# EAGLE schematic RD2166-v1.0.0 (EAGLE 9.3.1)

## Sheet 1 of 5
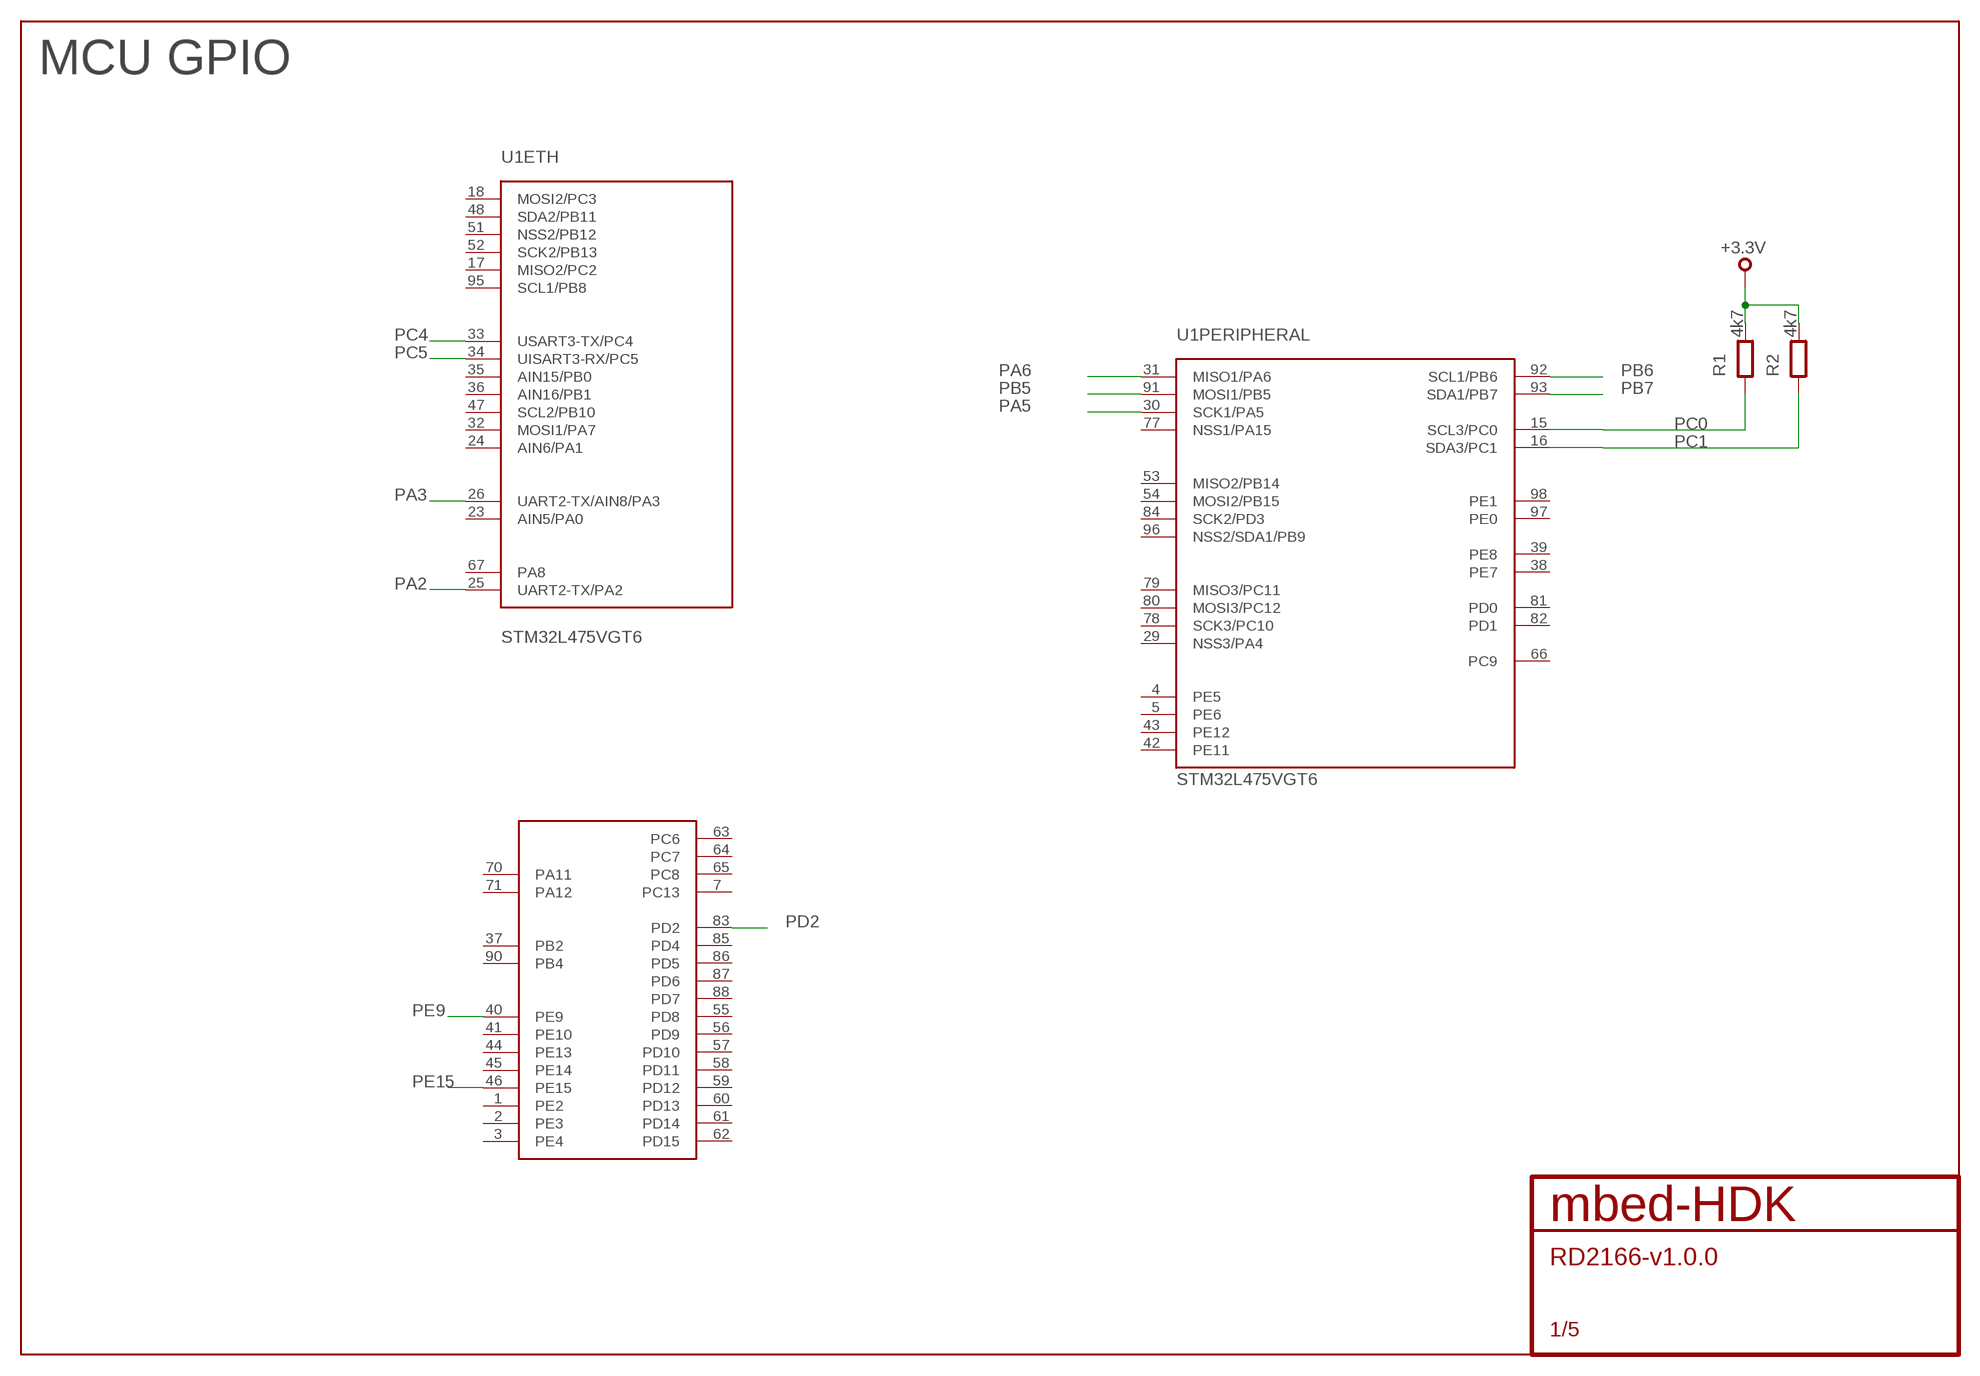
[diagram p0: schematic, sheet 1]

### Parts
R1  4k7  R0603  [0603]
R2  4k7  R0603  [0603]
U1  STM32L475VGT6  [QFP50P1600X1600X160-100N]

### Nets
+3.3V: R1.2 R2.2 ; also sheet 2,4
PA2: U1.25(ETH:UART2-TX/PA2) ; also sheet 4
PA3: U1.26(ETH:UART2-TX/AIN8/PA3) ; also sheet 4
PA5: U1.30(PERIPHERAL:SCK1/PA5) ; also sheet 2
PA6: U1.31(PERIPHERAL:MISO1/PA6) ; also sheet 2
PB5: U1.91(PERIPHERAL:MOSI1/PB5) ; also sheet 2
PB6: U1.92(PERIPHERAL:SCL1/PB6) ; also sheet 2
PB7: U1.93(PERIPHERAL:SDA1/PB7) ; also sheet 2
PC0: R1.1 U1.15(PERIPHERAL:SCL3/PC0)
PC1: R2.1 U1.16(PERIPHERAL:SDA3/PC1)
PC4: U1.33(ETH:USART3-TX/PC4) ; also sheet 4
PC5: U1.34(ETH:UISART3-RX/PC5) ; also sheet 4
PD2: U1.83(GPIO:PD2) ; also sheet 2
PE9: U1.40(GPIO:PE9) ; also sheet 4
PE15: U1.46(GPIO:PE15) ; also sheet 4
Unconnected: U1.1(GPIO:PE2) U1.2(GPIO:PE3) U1.3(GPIO:PE4) U1.4(PERIPHERAL:PE5) U1.5(PERIPHERAL:PE6) U1.7(GPIO:PC13) U1.17(ETH:MISO2/PC2) U1.18(ETH:MOSI2/PC3) U1.23(ETH:AIN5/PA0) U1.24(ETH:AIN6/PA1) U1.29(PERIPHERAL:NSS3/PA4) U1.32(ETH:MOSI1/PA7) U1.35(ETH:AIN15/PB0) U1.36(ETH:AIN16/PB1) U1.37(GPIO:PB2) U1.38(PERIPHERAL:PE7) U1.39(PERIPHERAL:PE8) U1.41(GPIO:PE10) U1.42(PERIPHERAL:PE11) U1.43(PERIPHERAL:PE12) U1.44(GPIO:PE13) U1.45(GPIO:PE14) U1.47(ETH:SCL2/PB10) U1.48(ETH:SDA2/PB11) U1.51(ETH:NSS2/PB12) U1.52(ETH:SCK2/PB13) U1.53(PERIPHERAL:MISO2/PB14) U1.54(PERIPHERAL:MOSI2/PB15) U1.55(GPIO:PD8) U1.56(GPIO:PD9) U1.57(GPIO:PD10) U1.58(GPIO:PD11) U1.59(GPIO:PD12) U1.60(GPIO:PD13) U1.61(GPIO:PD14) U1.62(GPIO:PD15) U1.63(GPIO:PC6) U1.64(GPIO:PC7) U1.65(GPIO:PC8) U1.66(PERIPHERAL:PC9) U1.67(ETH:PA8) U1.70(GPIO:PA11) U1.71(GPIO:PA12) U1.77(PERIPHERAL:NSS1/PA15) U1.78(PERIPHERAL:SCK3/PC10) U1.79(PERIPHERAL:MISO3/PC11) U1.80(PERIPHERAL:MOSI3/PC12) U1.81(PERIPHERAL:PD0) U1.82(PERIPHERAL:PD1) U1.84(PERIPHERAL:SCK2/PD3) U1.85(GPIO:PD4) U1.86(GPIO:PD5) U1.87(GPIO:PD6) U1.88(GPIO:PD7) U1.90(GPIO:PB4) U1.95(ETH:SCL1/PB8) U1.96(PERIPHERAL:NSS2/SDA1/PB9) U1.97(PERIPHERAL:PE0) U1.98(PERIPHERAL:PE1)

### Notes on the sheet
- MCU GPIO

## Sheet 2 of 5
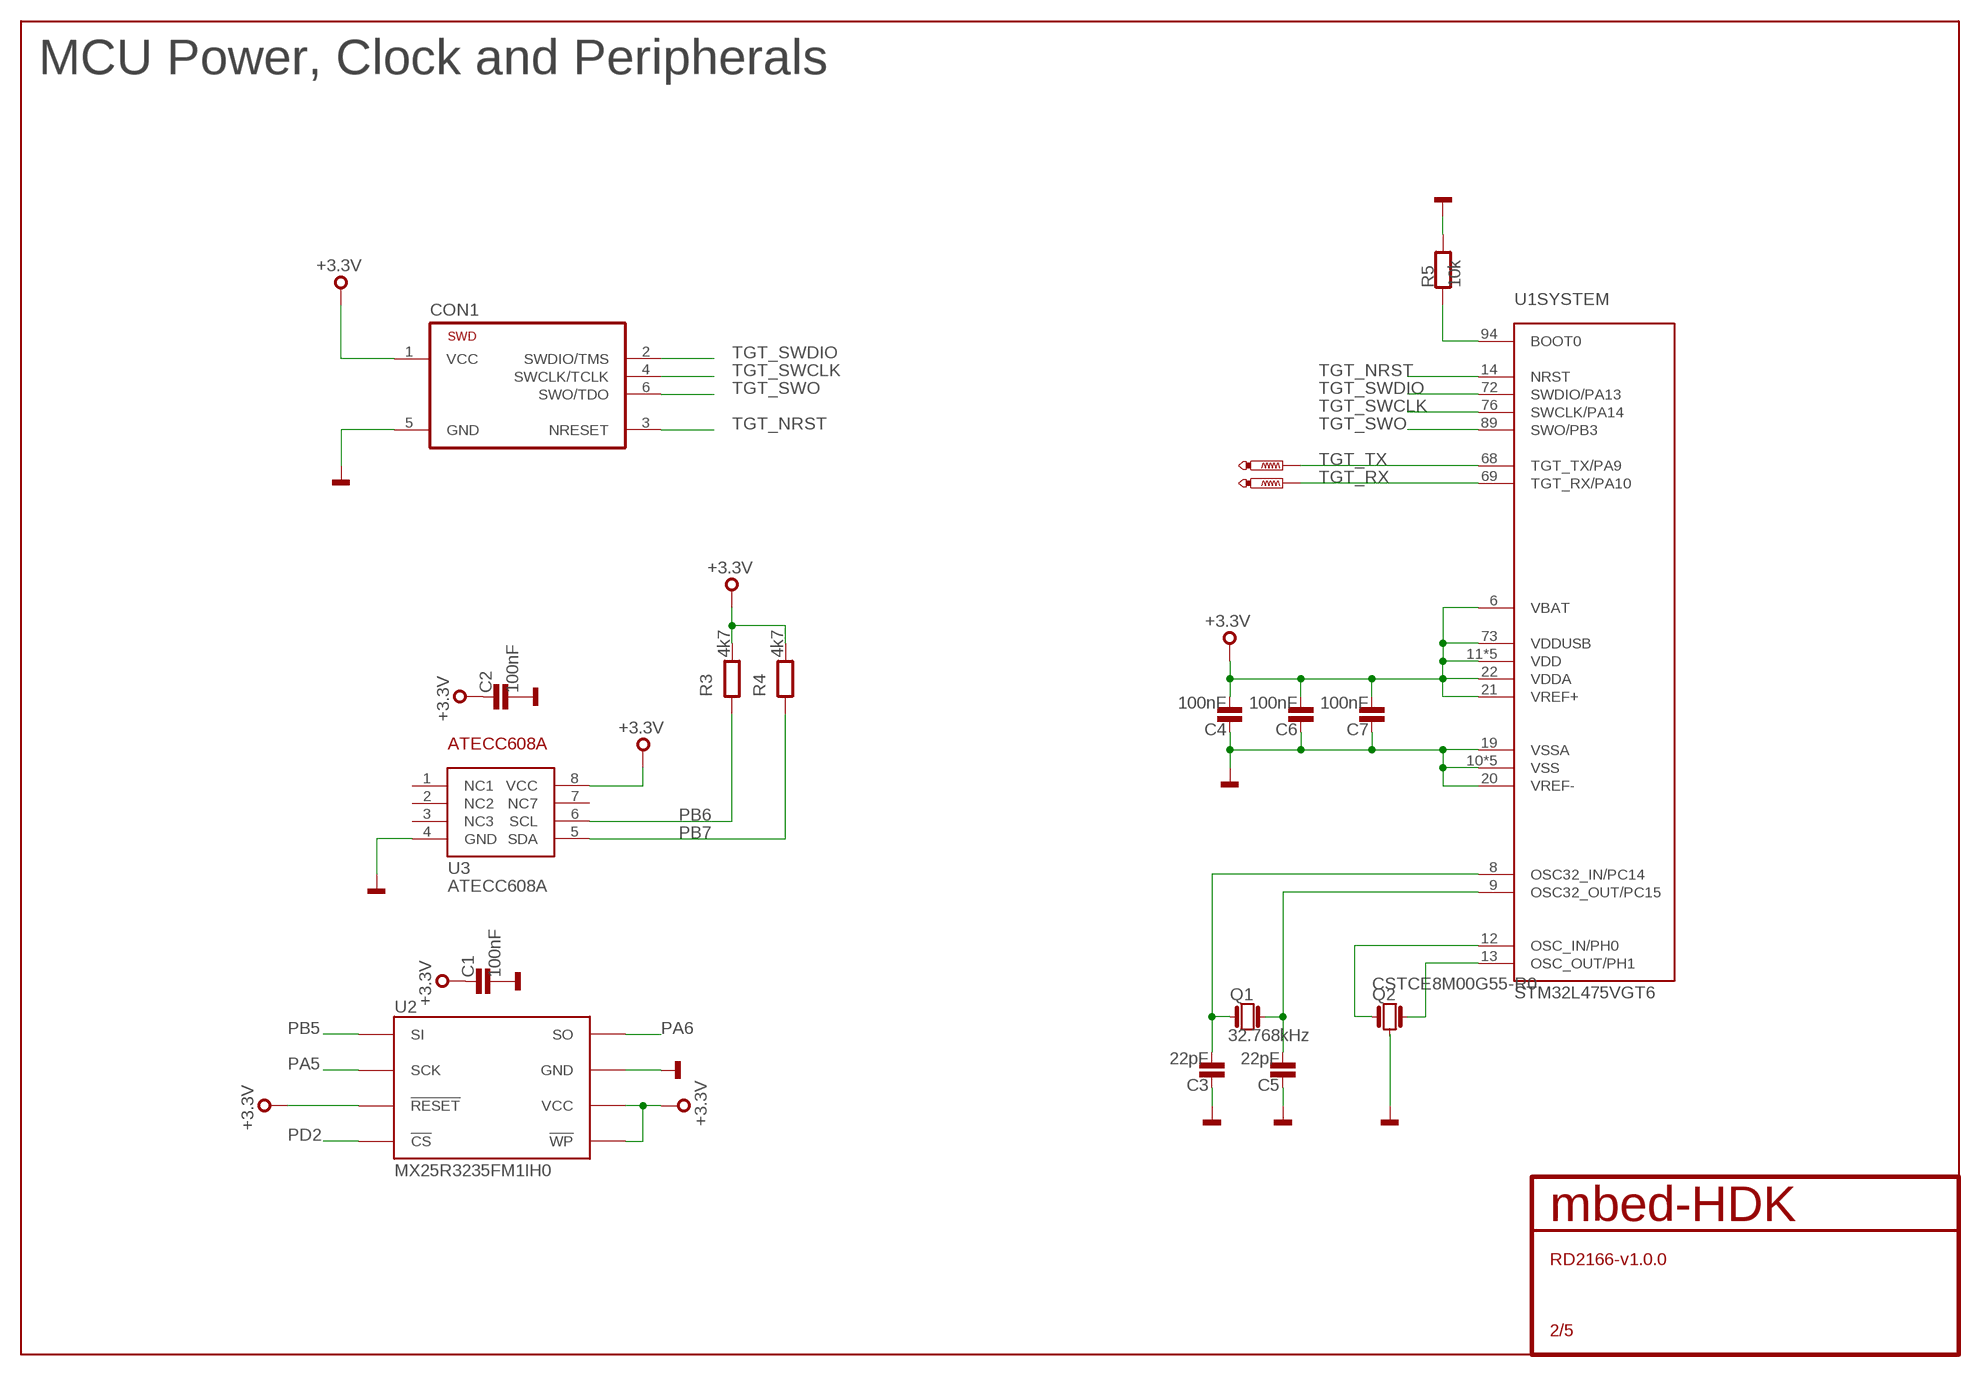
[diagram p1: schematic, sheet 2]

### Parts
C1  100nF  C0603  [0603]
C2  100nF  C0603  [0603]
C3  22pF  C0603  [0603]
C4  100nF  C0603  [0603]
C5  22pF  C0603  [0603]
C6  100nF  C0603  [0603]
C7  100nF  C0603  [0603]
CON1  TC2030-CTX-NL  [TC2030-CTX-NL]
Q1  32.768kHz  GENERIC-CRYSTAL_FC135  [FC135]
Q2  CSTCE8M00G55-R0  [CSTCE8M00G55-R0]
R3  4k7  R0603  [0603]
R4  4k7  R0603  [0603]
R5  10k  R0603  [0603]
TP1  PTR1TP06R  [TP06R]
TP2  PTR1TP06R  [TP06R]
U2  MX25R3235FM1IH0  [SO8]
U3  ATECC608A  [SO8]

### Nets
+3.3V: C1.1 C2.1 C4.2 C6.2 C7.2 CON1.1(VCC) R3.2 R4.2 U1.6(SYSTEM:VBAT) U1.11(SYSTEM:VDD) U1.21(SYSTEM:VREF+) U1.22(SYSTEM:VDDA) U1.28(SYSTEM:VDD) U1.50(SYSTEM:VDD) U1.73(SYSTEM:VDDUSB) U1.75(SYSTEM:VDD) U1.100(SYSTEM:VDD) U2.3(!WP) U2.7(!RESET) U2.8(VCC) U3.8(VCC) ; also sheet 1,4
GND: C1.2 C2.2 C3.1 C4.1 C5.1 C6.1 C7.1 CON1.5(GND) Q2.2 R5.2 U1.10(SYSTEM:VSS) U1.19(SYSTEM:VSSA) U1.20(SYSTEM:VREF-) U1.27(SYSTEM:VSS) U1.49(SYSTEM:VSS) U1.74(SYSTEM:VSS) U1.99(SYSTEM:VSS) U2.4(GND) U3.4(GND) ; also sheet 3,4,5
N$44: R5.1 U1.94(SYSTEM:BOOT0)
N$55: Q2.1 U1.12(SYSTEM:OSC_IN/PH0)
N$62: Q2.3 U1.13(SYSTEM:OSC_OUT/PH1)
N$73: C5.2 Q1.X2 U1.9(SYSTEM:OSC32_OUT/PC15)
N$76: C3.2 Q1.X1 U1.8(SYSTEM:OSC32_IN/PC14)
PA5: U2.6(SCK) ; also sheet 1
PA6: U2.2(SO) ; also sheet 1
PB5: U2.5(SI) ; also sheet 1
PB6: R3.1 U3.6(SCL) ; also sheet 1
PB7: R4.1 U3.5(SDA) ; also sheet 1
PD2: U2.1(!CS) ; also sheet 1
TGT_NRST: CON1.3(NRESET) U1.14(SYSTEM:NRST)
TGT_RX: TP2.TP U1.69(SYSTEM:TGT_RX/PA10)
TGT_SWCLK: CON1.4(SWCLK/TCLK) U1.76(SYSTEM:SWCLK/PA14)
TGT_SWDIO: CON1.2(SWDIO/TMS) U1.72(SYSTEM:SWDIO/PA13)
TGT_SWO: CON1.6(SWO/TDO) U1.89(SYSTEM:SWO/PB3)
TGT_TX: TP1.TP U1.68(SYSTEM:TGT_TX/PA9)
Unconnected: U3.1(NC1) U3.2(NC2) U3.3(NC3) U3.7(NC7)

### Notes on the sheet
- MCU Power, Clock and Peripherals

## Sheet 3 of 5
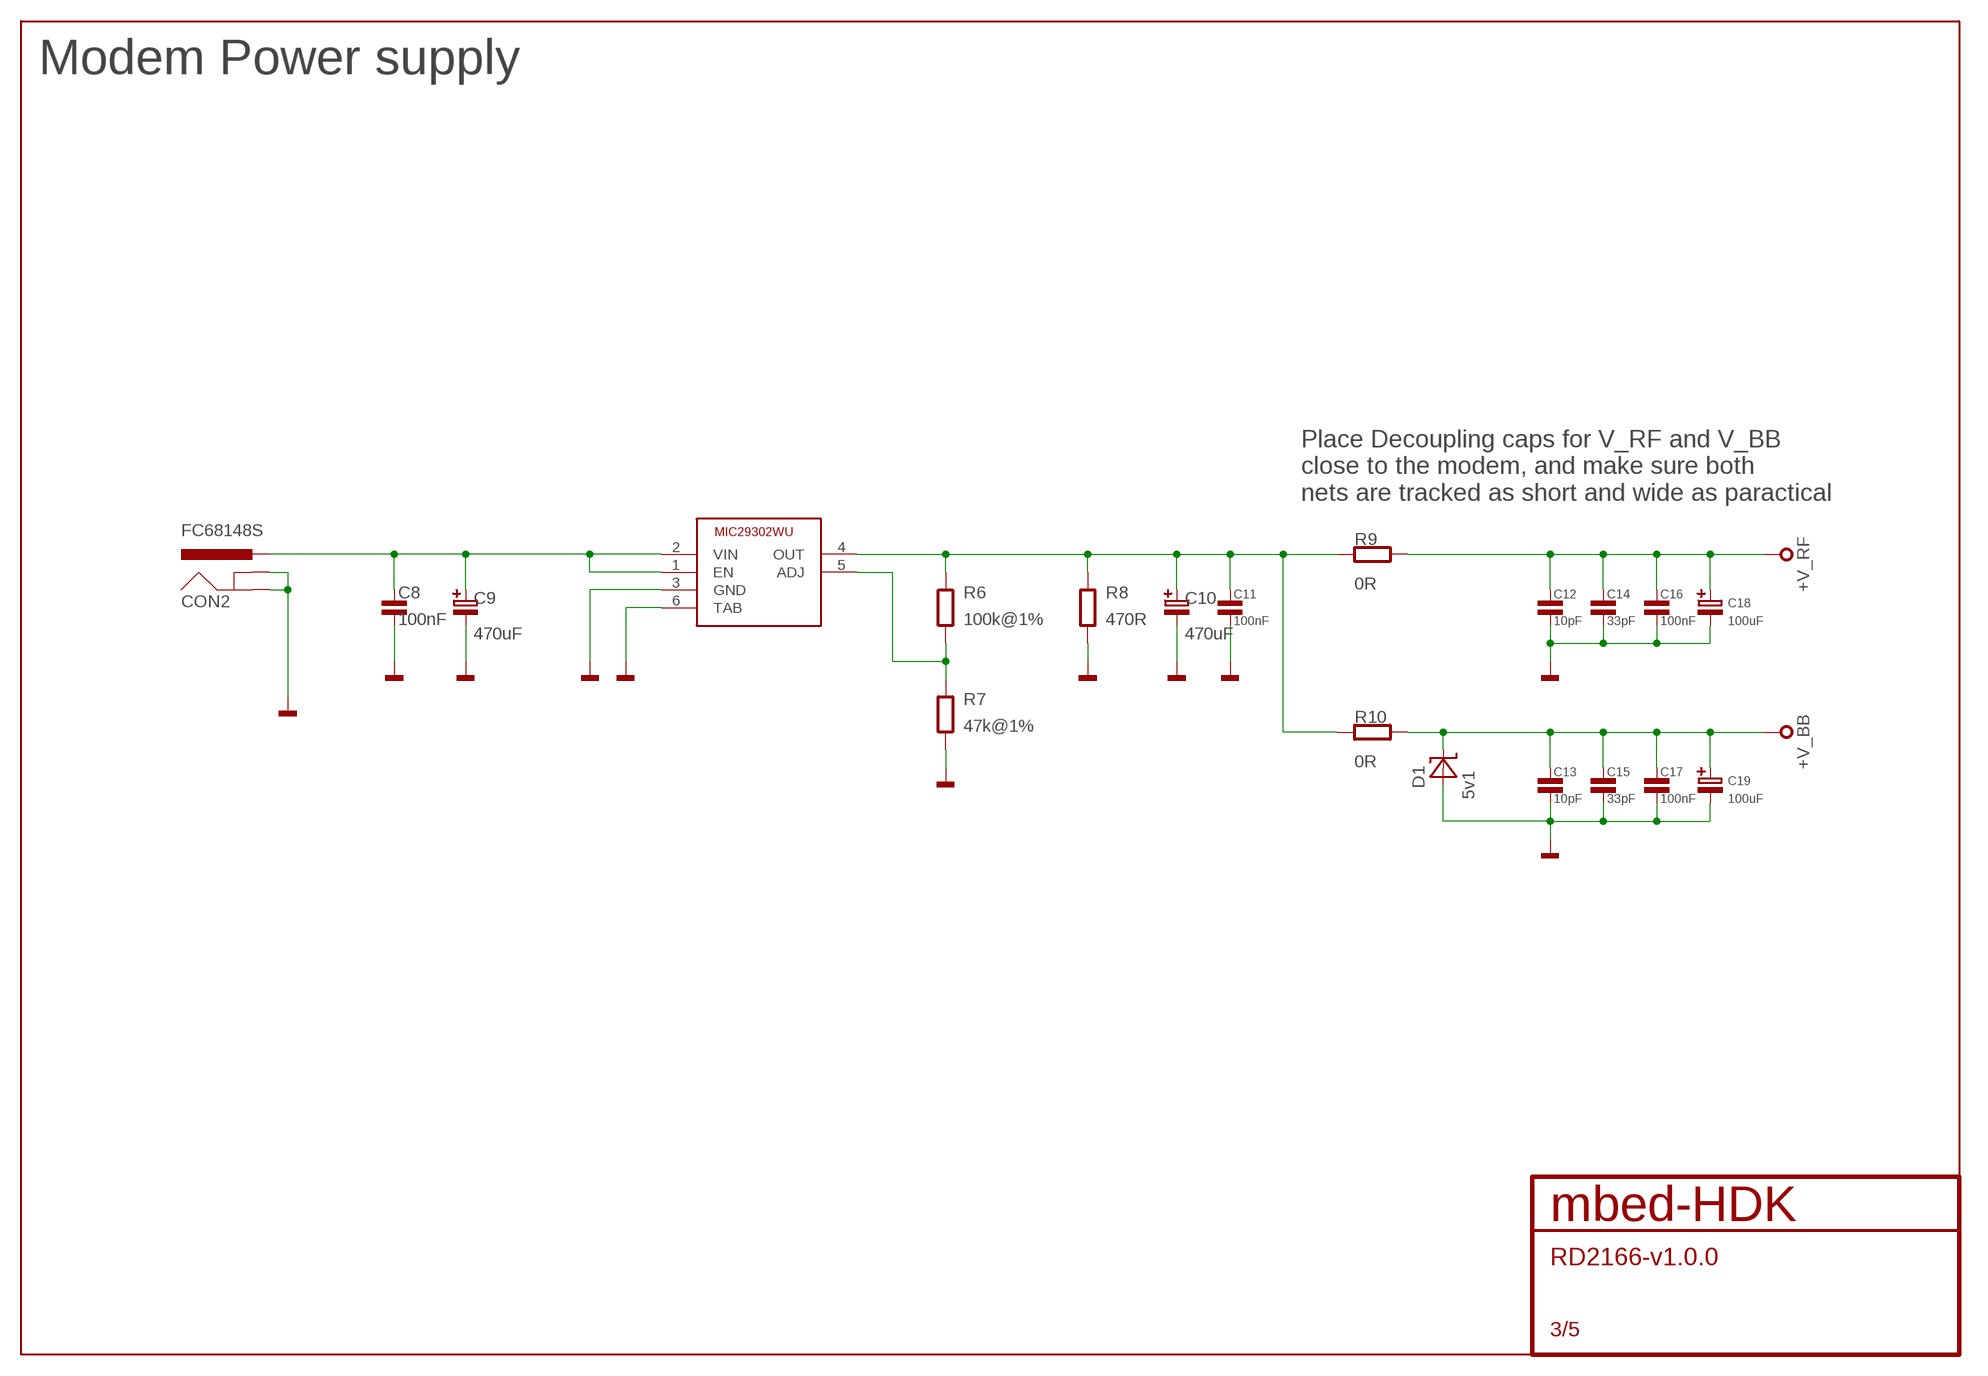
[diagram p2: schematic, sheet 3]

### Parts
C8  100nF  C0603  [0603]
C9  470uF  C-POL_G  [PANASONIC_G]
C10  470uF  C-POL_G  [PANASONIC_G]
C11  100nF  C0603  [0603]
C12  10pF  C0603  [0603]
C13  10pF  C0603  [0603]
C14  33pF  C0603  [0603]
C15  33pF  C0603  [0603]
C16  100nF  C0603  [0603]
C17  100nF  C0603  [0603]
C18  100uF  C-POLA  [SMC_A]
C19  100uF  C-POLA  [SMC_A]
CON2  FC68148S  [FC68148S]
D1  5v1  DIODE-ZENER  [SOD123]
IC1  MIC29302WU  [TO263-5]
R6  100k@1%  R0603  [0603]
R7  47k@1%  R0603  [0603]
R8  470R  R0603  [0603]
R9  0R  R0603  [0603]
R10  0R  R0603  [0603]

### Nets
+V_BB: C13.1 C15.1 C17.1 C19.+ D1.2(C) R10.2 ; also sheet 4
+V_RF: C12.1 C14.1 C16.1 C18.+ R9.2 ; also sheet 4
GND: C8.2 C9.- C10.- C11.2 C12.2 C13.2 C14.2 C15.2 C16.2 C17.2 C18.- C19.- CON2.2(GNDBREAK) CON2.3(GND) D1.1(A) IC1.3(GND) IC1.6(TAB) R7.1 R8.1 ; also sheet 2,4,5
N$41: C8.1 C9.+ CON2.1-1(PWR) CON2.1-2(PWR) IC1.1(EN) IC1.2(VIN)
N$42: IC1.5(ADJ) R6.1 R7.2
N$71: C10.+ C11.1 IC1.4(OUT) R6.2 R8.2 R9.1 R10.1

### Notes on the sheet
- Modem Power supply
- Place Decoupling caps for V_RF and V_BB
  close to the modem, and make sure both
  nets are tracked as short and wide as paractical

## Sheet 4 of 5
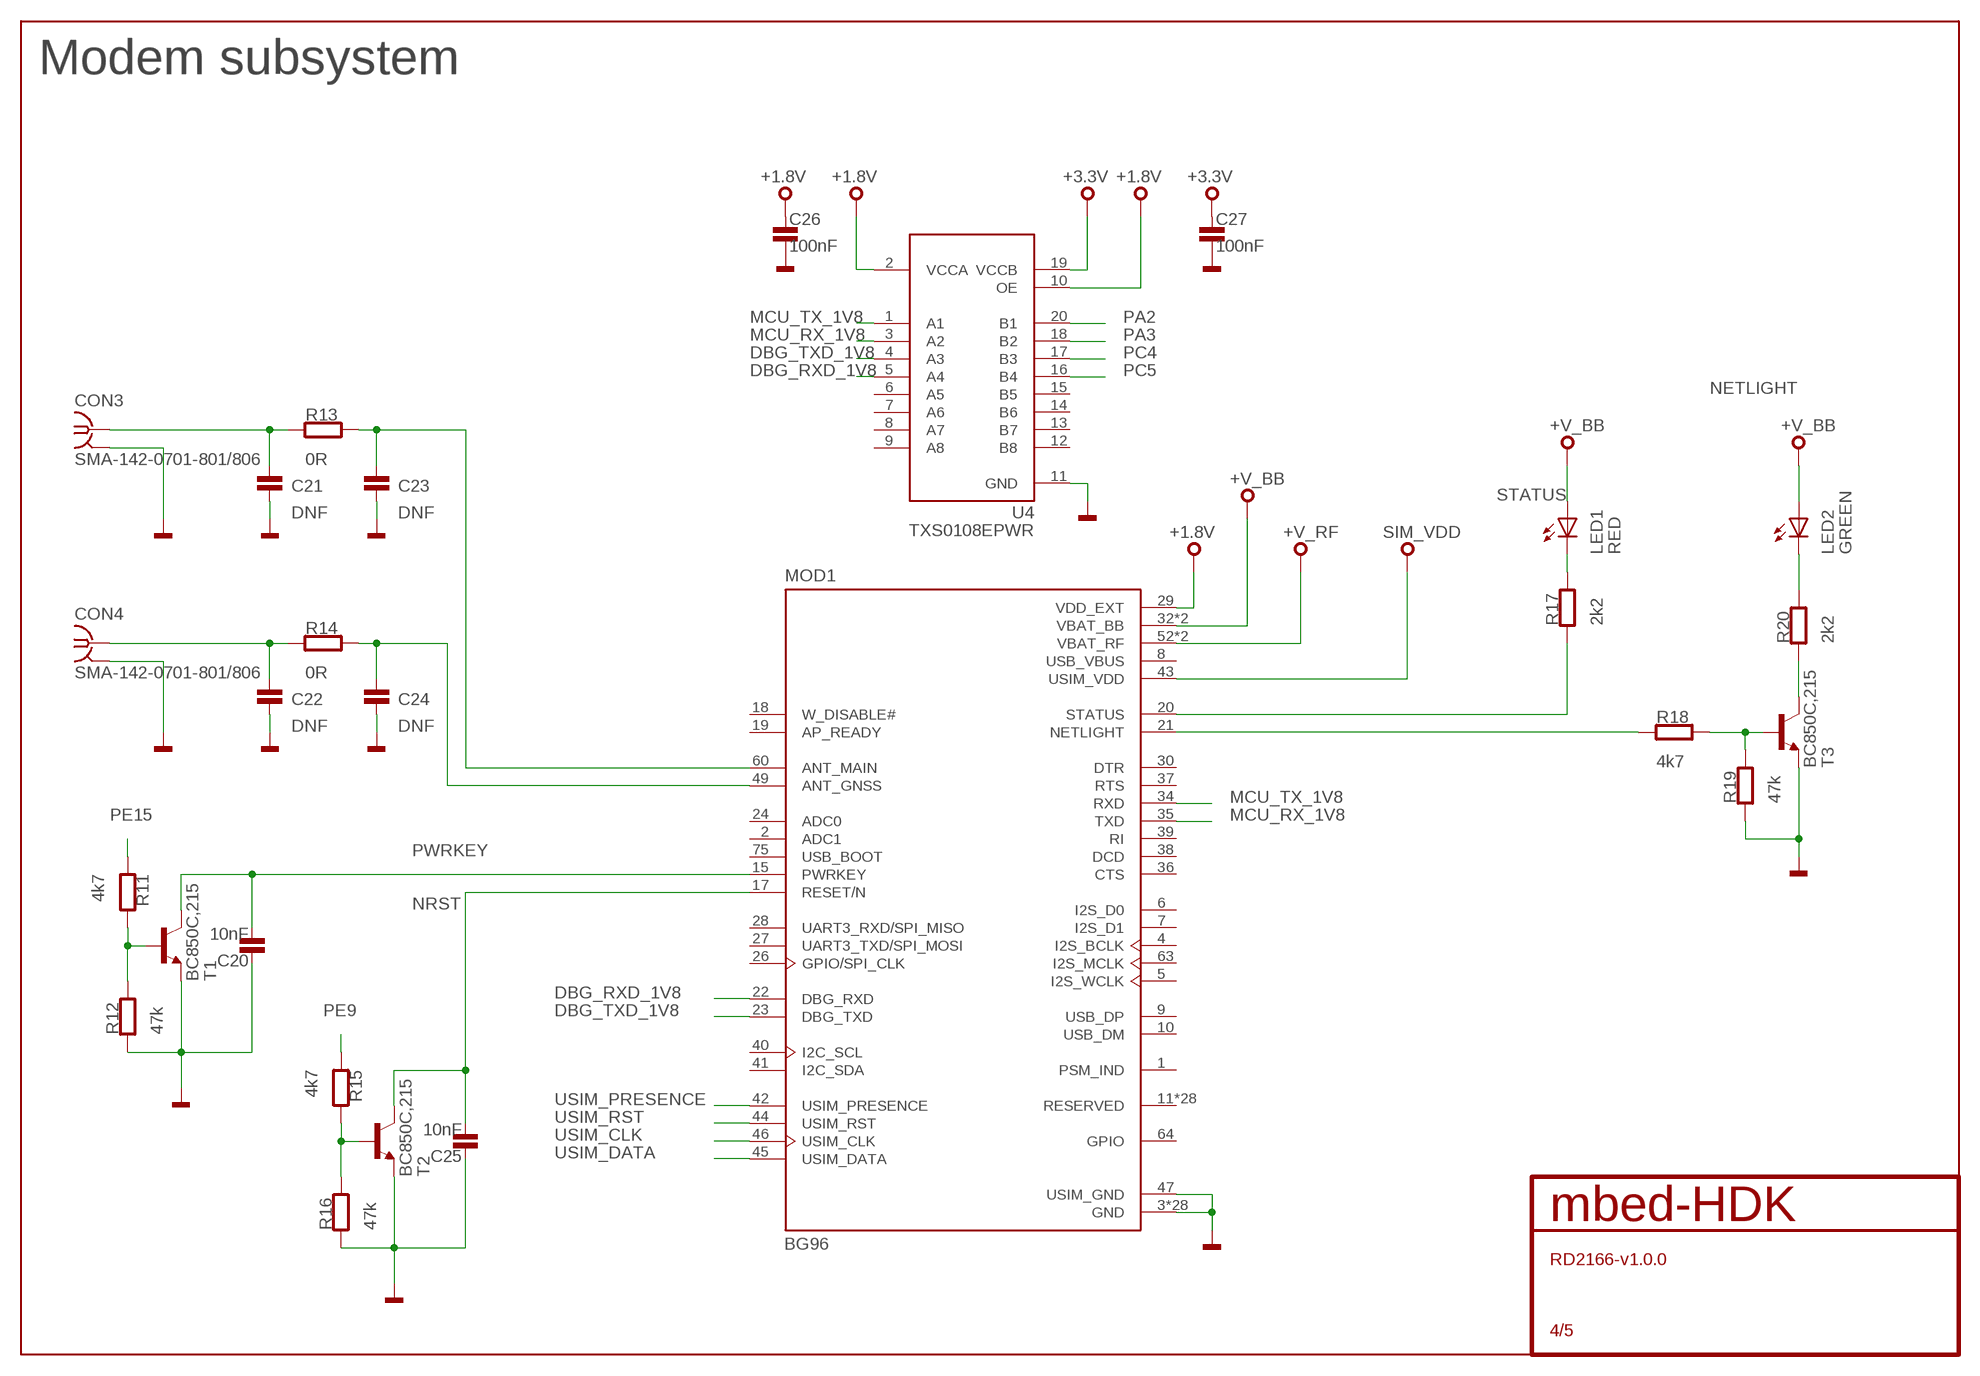
[diagram p3: schematic, sheet 4]

### Parts
C20  10nF  C0603  [0603]
C21  DNF  C0603  [0603]
C22  DNF  C0603  [0603]
C23  DNF  C0603  [0603]
C24  DNF  C0603  [0603]
C25  10nF  C0603  [0603]
C26  100nF  C0603  [0603]
C27  100nF  C0603  [0603]
CON3  SMA-142-0701-801/806  [J502-ND-142-0701-801/806]
CON4  SMA-142-0701-801/806  [J502-ND-142-0701-801/806]
LED1  RED  LED0603  [CHIPLED_0603]
LED2  GREEN  LED0603  [CHIPLED_0603]
MOD1  BG96  [LTE_MODULE_BG96]
R11  4k7  R0603  [0603]
R12  47k  R0603  [0603]
R13  0R  R0603  [0603]
R14  0R  R0603  [0603]
R15  4k7  R0603  [0603]
R16  47k  R0603  [0603]
R17  2k2  R0603  [0603]
R18  4k7  R0603  [0603]
R19  47k  R0603  [0603]
R20  2k2  R0603  [0603]
T1  BC850C,215  [SOT23-3]
T2  BC850C,215  [SOT23-3]
T3  BC850C,215  [SOT23-3]
U4  TXS0108EPWR  [TSSOP-20]

### Nets
+1.8V: C26.1 MOD1.29(VDD_EXT) U4.2(VCCA) U4.10(OE) ; also sheet 5
+3.3V: C27.1 U4.19(VCCB) ; also sheet 1,2
+V_BB: LED1.A LED2.A MOD1.32(VBAT_BB) MOD1.33(VBAT_BB) ; also sheet 3
+V_RF: MOD1.52(VBAT_RF) MOD1.53(VBAT_RF) ; also sheet 3
DBG_RXD_1V8: MOD1.22(DBG_RXD) U4.5(A4)
DBG_TXD_1V8: MOD1.23(DBG_TXD) U4.4(A3)
GND: C20.1 C21.1 C22.1 C23.1 C24.1 C25.1 C26.2 C27.2 CON3.G@1 CON3.G@2 CON3.G@3 CON3.G@4 CON4.G@1 CON4.G@2 CON4.G@3 CON4.G@4 MOD1.3(GND) MOD1.31(GND) MOD1.47(USIM_GND) MOD1.48(GND) MOD1.50(GND) MOD1.54(GND) MOD1.55(GND) MOD1.58(GND) MOD1.59(GND) MOD1.61(GND) MOD1.62(GND) MOD1.67(GND) MOD1.68(GND) MOD1.69(GND) MOD1.70(GND) MOD1.71(GND) MOD1.72(GND) MOD1.73(GND) MOD1.74(GND) MOD1.79(GND) MOD1.80(GND) MOD1.81(GND) MOD1.82(GND) MOD1.89(GND) MOD1.90(GND) MOD1.91(GND) MOD1.100(GND) MOD1.101(GND) MOD1.102(GND) R12.1 R16.1 R19.1 T1.2(E) T2.2(E) T3.2(E) U4.11(GND) ; also sheet 2,3,5
MCU_RX_1V8: MOD1.35(TXD) U4.3(A2)
MCU_TX_1V8: MOD1.34(RXD) U4.1(A1)
N$4: LED1.C R17.2
N$8: LED2.C R20.2
N$29: C21.2 CON3.1 R13.1
N$30: C23.2 MOD1.60(ANT_MAIN) R13.2
N$43: C22.2 CON4.1 R14.1
N$45: C24.2 MOD1.49(ANT_GNSS) R14.2
N$46: R11.2 R12.2 T1.1(B)
N$49: R15.2 R16.2 T2.1(B)
N$58: R18.2 R19.2 T3.1(B)
NETLIGHT: MOD1.21(NETLIGHT) R18.1
NRST: C25.2 MOD1.17(RESET/N) T2.3(C)
NRST1: R20.1 T3.3(C)
PA2: U4.20(B1) ; also sheet 1
PA3: U4.18(B2) ; also sheet 1
PC4: U4.17(B3) ; also sheet 1
PC5: U4.16(B4) ; also sheet 1
PE9: R15.1 ; also sheet 1
PE15: R11.1 ; also sheet 1
PWRKEY: C20.2 MOD1.15(PWRKEY) T1.3(C)
SIM_VDD: MOD1.43(USIM_VDD) ; also sheet 5
STATUS: MOD1.20(STATUS) R17.1
USIM_CLK: MOD1.46(USIM_CLK) ; also sheet 5
USIM_DATA: MOD1.45(USIM_DATA) ; also sheet 5
USIM_PRESENCE: MOD1.42(USIM_PRESENCE) ; also sheet 5
USIM_RST: MOD1.44(USIM_RST) ; also sheet 5
Unconnected: MOD1.1(PSM_IND) MOD1.2(ADC1) MOD1.4(I2S_BCLK) MOD1.5(I2S_WCLK) MOD1.6(I2S_D0) MOD1.7(I2S_D1) MOD1.9(USB_DP) MOD1.10(USB_DM) MOD1.11(RESERVED) MOD1.12(RESERVED) MOD1.13(RESERVED) MOD1.14(RESERVED) MOD1.16(RESERVED) MOD1.18(W_DISABLE#) MOD1.19(AP_READY) MOD1.24(ADC0) MOD1.25(RESERVED) MOD1.26(GPIO/SPI_CLK) MOD1.27(UART3_TXD/SPI_MOSI) MOD1.28(UART3_RXD/SPI_MISO) MOD1.30(DTR) MOD1.36(CTS) MOD1.37(RTS) MOD1.38(DCD) MOD1.39(RI) MOD1.40(I2C_SCL) MOD1.41(I2C_SDA) MOD1.51(RESERVED) MOD1.56(RESERVED) MOD1.57(RESERVED) MOD1.63(I2S_MCLK) MOD1.64(GPIO) MOD1.65(RESERVED) MOD1.66(RESERVED) MOD1.75(USB_BOOT) MOD1.76(RESERVED) MOD1.77(RESERVED) MOD1.78(RESERVED) MOD1.83(RESERVED) MOD1.84(RESERVED) MOD1.85(RESERVED) MOD1.86(RESERVED) MOD1.87(RESERVED) MOD1.88(RESERVED) MOD1.92(RESERVED) MOD1.93(RESERVED) MOD1.94(RESERVED) MOD1.95(RESERVED) MOD1.96(RESERVED) MOD1.97(RESERVED) MOD1.98(RESERVED) MOD1.99(RESERVED) U4.6(A5) U4.7(A6) U4.8(A7) U4.9(A8) U4.12(B8) U4.13(B7) U4.14(B6) U4.15(B5)

### Notes on the sheet
- Modem subsystem

## Sheet 5 of 5
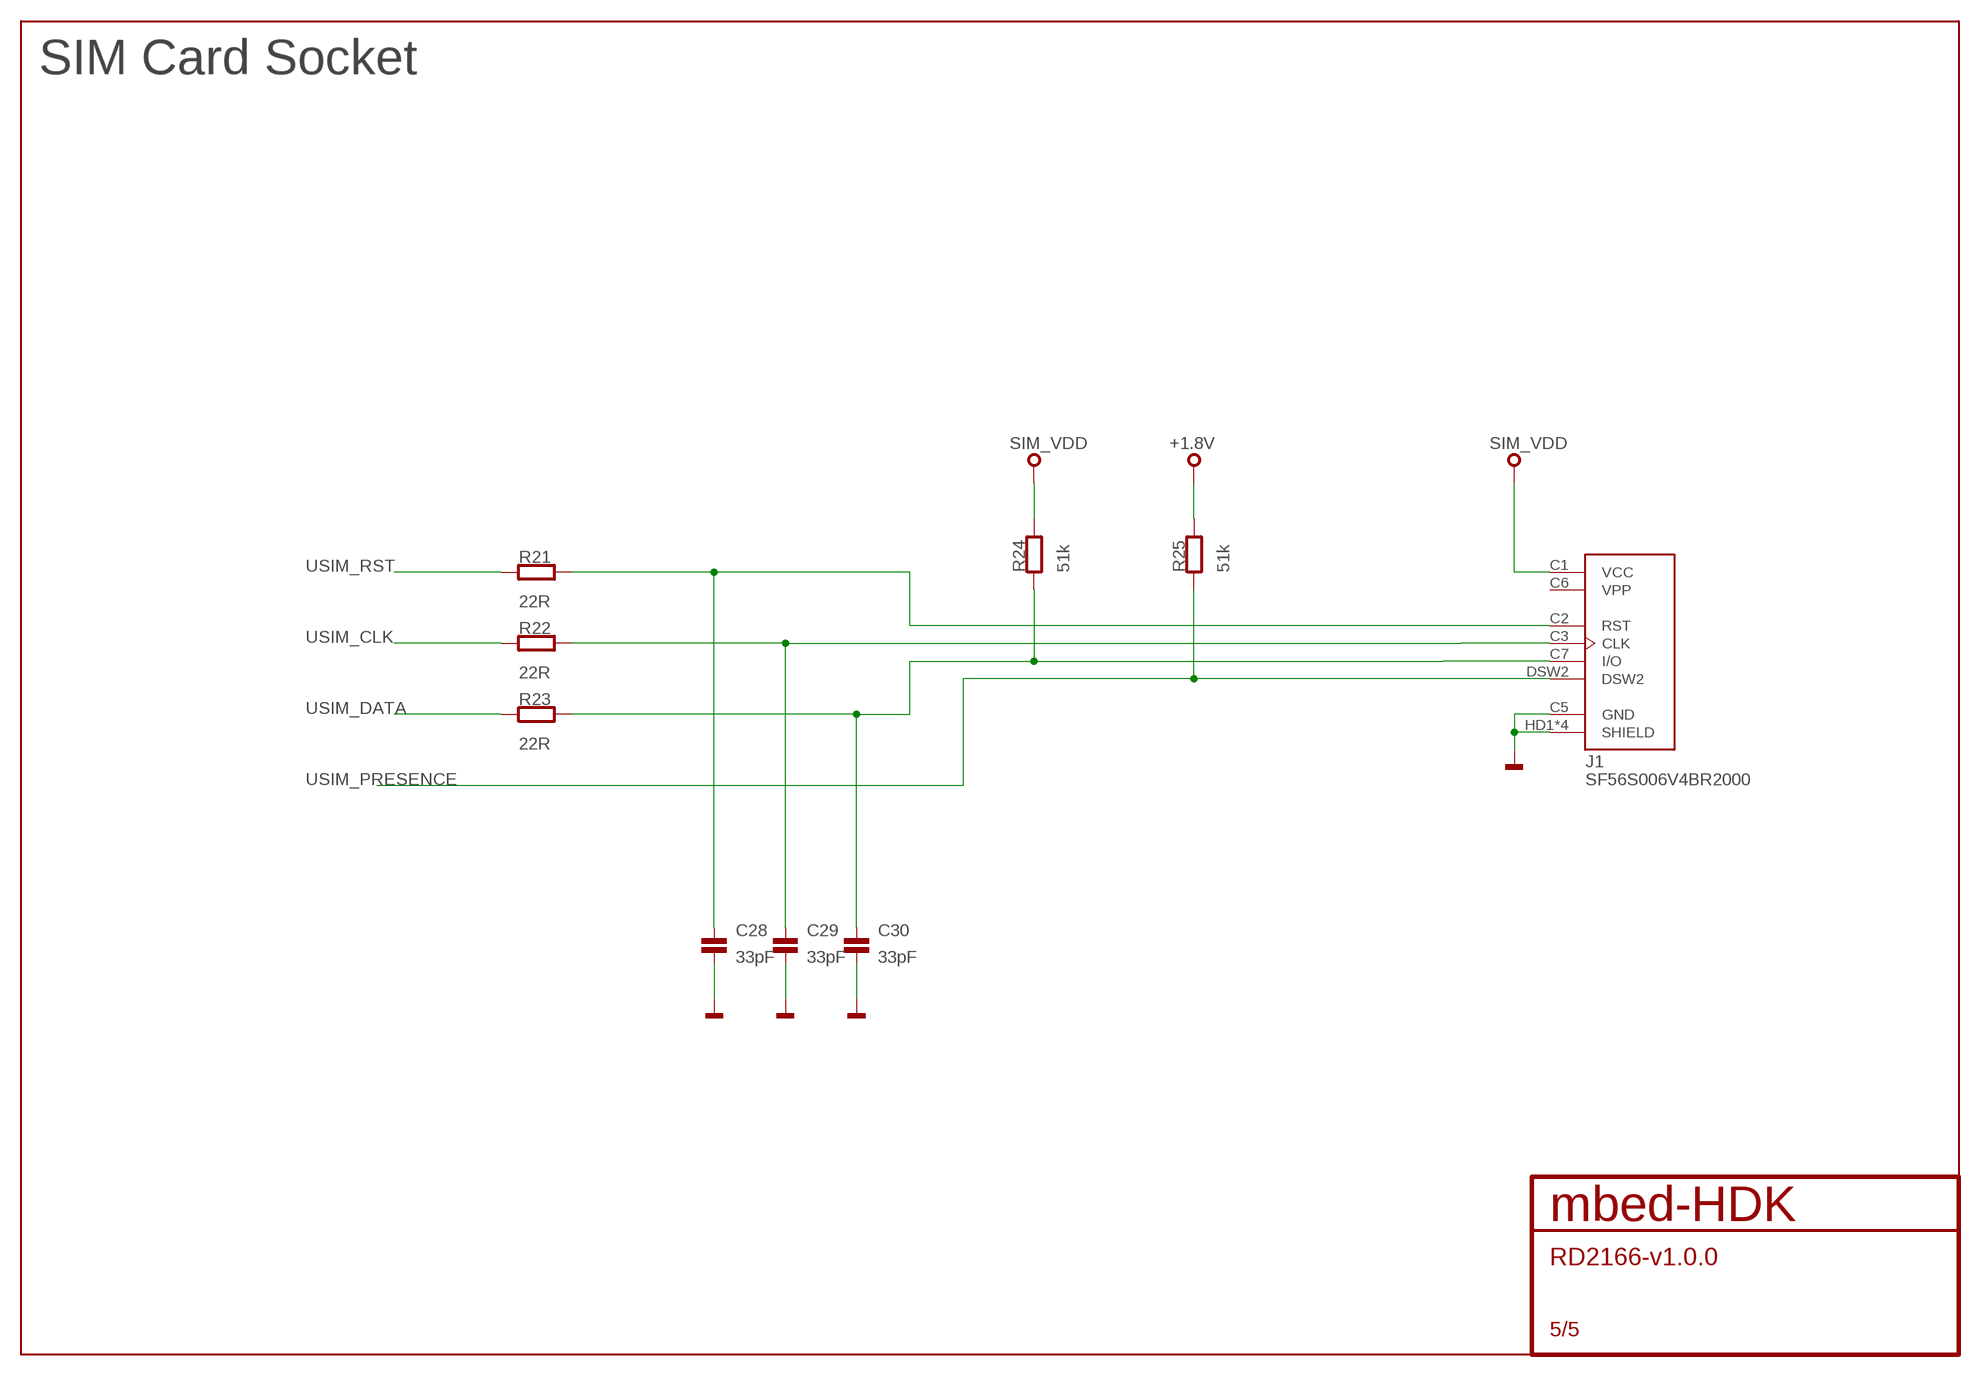
[diagram p4: schematic, sheet 5]

### Parts
C28  33pF  C0603  [0603]
C29  33pF  C0603  [0603]
C30  33pF  C0603  [0603]
J1  SF56S006V4BR2000  [JAE_SF56S006V4BR2000]
R21  22R  R0603  [0603]
R22  22R  R0603  [0603]
R23  22R  R0603  [0603]
R24  51k  R0603  [0603]
R25  51k  R0603  [0603]

### Nets
+1.8V: R25.2 ; also sheet 4
GND: C28.2 C29.2 C30.2 J1.C5(GND) J1.HD1(SHIELD) J1.HD2,DSW1(SHIELD) J1.HD3(SHIELD) J1.HD4(SHIELD) ; also sheet 2,3,4
N$60: C28.1 J1.C2(RST) R21.2
N$66: C29.1 J1.C3(CLK) R22.2
N$67: C30.1 J1.C7(I/O) R23.2 R24.1
SIM_VDD: J1.C1(VCC) R24.2 ; also sheet 4
USIM_CLK: R22.1 ; also sheet 4
USIM_DATA: R23.1 ; also sheet 4
USIM_PRESENCE: J1.DSW2 R25.1 ; also sheet 4
USIM_RST: R21.1 ; also sheet 4

### Notes on the sheet
- SIM Card Socket

## Power pins joined to a net without a drawn wire
USB_VBUS: MOD1.8(USB_VBUS)
VPP: J1.C6(VPP)

## Library data of the parts
C1-C8 C11-C17 C20-C30 = mbed-HDK-RLC:C: Capacitor
C9 C10 C18 C19 = mbed-HDK-RLC:C-POL: Polarised capacitor
CON1 = mbed-HDK-Connector:TC2030-CTX: Tag-Connect In Circuit Programming & Debug Cable 6 Pin
CON2 = mbed-HDK-Connector:FC68148S: Power Jack This is the standard 5.5mm barrel jack for power. The PTH is the most common, proven, reliable, footprint. The Slot footprint only works if the mill layer is transmitted to the PCB fab house so be warned. Mating wall wart : TOL-00298 (and others); MF: Cliff; MFN: FC68148S; OC_NEWARK: 1889309
CON3 CON4 = mbed-HDK-Connector:SMA-: SMA 50 Ohm End Launch Jack Receptacle - Round Contact Johnson Components Source: www.johnsoncomponents.com .. J502-ND.pdf; MF: JOHNSON COMPONENTS; MPN: 142-0701-801; OC_FARNELL: 1608592; OC_NEWARK: 90F2624
D1 = mbed-HDK-Discrete:DIODE-ZENER
IC1 = SnapEDA:MIC29302WU; AVAILABILITY: Unavailable; DESCRIPTION: MIC29302 Series 3 A 1.24 to 26 V ADJ Output Voltage LDO Regulator - TO-263-5; MF: Microchip; MP: MIC29302WU; PACKAGE: TO-263-5 Microchip; PRICE: None
J1 = SnapEDA:SF56S006V4BR2000: CONN MICRO SIM CARD PUSH-PUSH; DESCRIPTION: SF56 series, micro-SIM card connector, push-push type, normal closed; DIGI-KEY_PART_NUMBER: 670-2834-1-ND; DIGI-KEY_PURCHASE_URL: https://www.digikey.co.uk/product-detail/en/jae-electronics/SF56S006V4BR2000/670-2834-1-ND/5280152?utm_source=snapeda&utm_medium=aggregator&utm_campaign=symbol; MF: JAE Electronics; MP: SF56S006V4BR2000; PACKAGE: None
LED1 LED2 = mbed-HDK-Optical:LED: LED SMD
MOD1 = SnapEDA:BG96: Lte Cat.M1 Module For Global Sku; AVAILABILITY: Unavailable; DESCRIPTION: Lte Cat.M1 Module For Global Sku; MF: Quectel; MP: BG96; PACKAGE: None; PRICE: 124.49 USD
Q1 = mbed-HDK-Oscillator:GENERIC-CRYSTAL: GENERIC Crystal
Q2 = mbed-HDK-Oscillator:CSTCE8M00G55-R0: Resonator Cermanic, Murata 8MHz 33pF; MF: Murata; MFN: CSTCE8M00G55-R0; OC-DIGIKEY: 490-1195-1-ND; OC-MOUSER: 81-CSTCE8M00G55-R0; OC-NEWARK: 2443270
R1-R25 = mbed-HDK-RLC:R: Resistor
T1-T3 = mbed-HDK-Discrete:BC850C,215: BJT NPN; DIGIKEY-OC: 568-6077-1-ND; MF: NXP Semiconductors; MFN: BC850C,215; MOUSER-OC: 771-BC850C-T/R; NEWARK-OC: 75R0745
TP1 TP2 = testpad:PTR1: TEST PIN
U1 = STM32L475VGT6:STM32L475VGT6
U2 = mbed-HDK-IC:MX25R3235FM1IH0: Serial Flash 32 Mb 80 Mhz; MF: Macronix; MFN: MX25R3235FM1IH0; OC-DIGIKEY: 1092-1175-ND
U3 = mbed-HDK-MF-ATMEL:ATECC608A
U4 = mbed-HDK-IC:TXS0108EPWR: 8-Bit Bi-directional, Level-Shifting, Voltage Translator; MF: Texas Instruments; MFN: TXS0108EPWR; OC-DIGIKEY: 296-23011-1-ND; OC-MOUSER: 595-TXS0108EPWR; OC-NEWARK: 05R8300